# Altium schematic sheet MCU.SchDoc: Microcontroller Unit (MCU)
size A; Author: Micheal Burin; Revision: 1.0; SheetNumber: 2; SheetTotal: 10
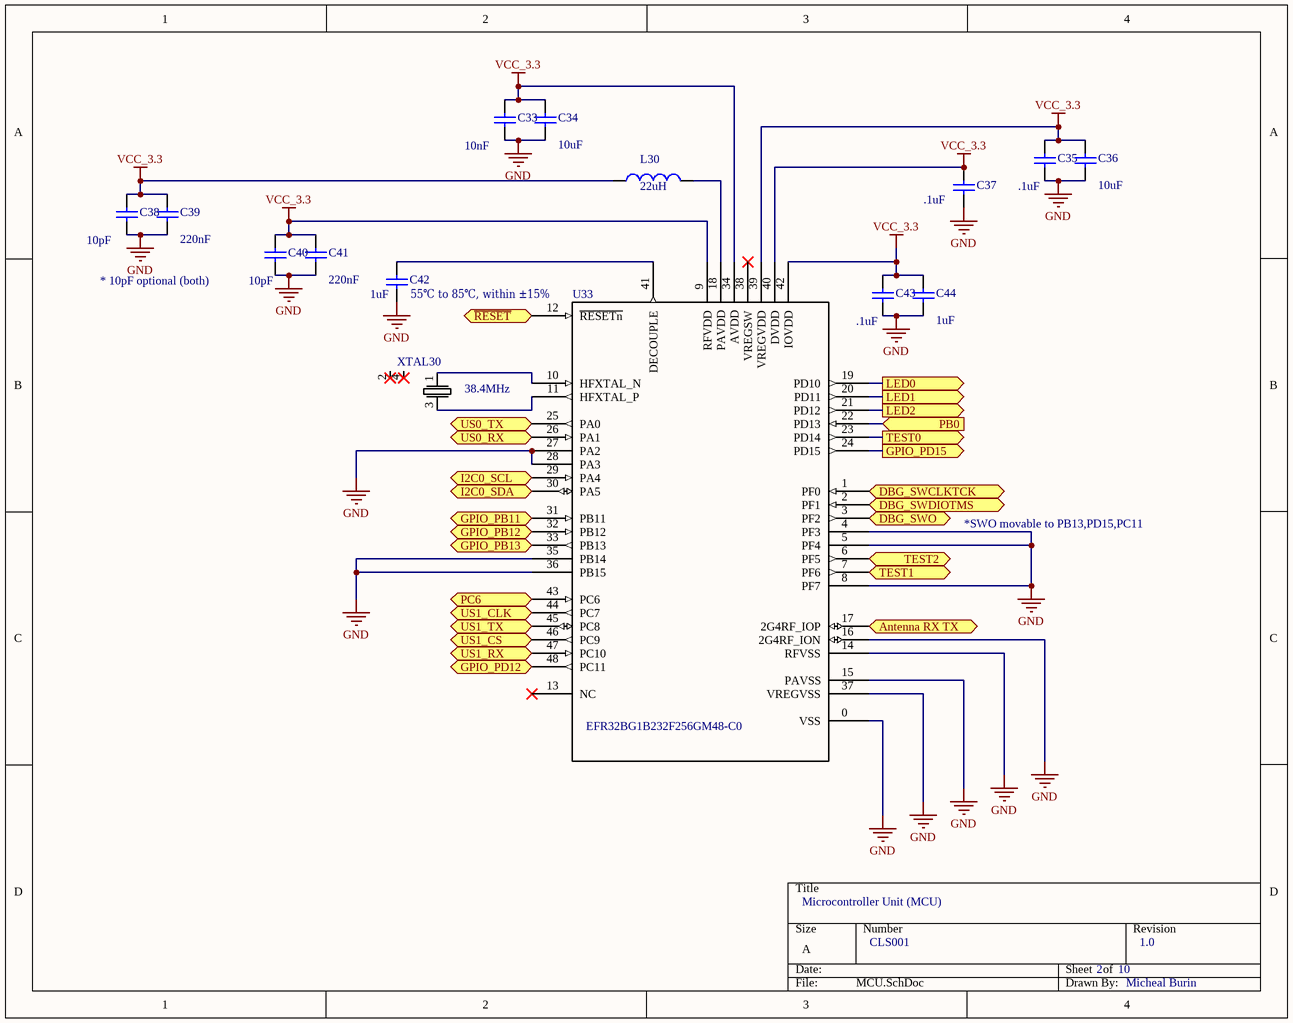
[diagram p0: MCU.SchDoc]

## Parts
C33  value 10nF  [0805_CHIP_FP]  (hidden comment: Capacitor_unpolarized_0805)
C34  value 10uF  [0805_CHIP_FP]  (hidden comment: Capacitor_unpolarized_0805)
C35  value .1uF  [0805_CHIP_FP]  (hidden comment: Capacitor_unpolarized_0805)
C36  value 10uF  [0805_CHIP_FP]  (hidden comment: Capacitor_unpolarized_0805)
C37  value .1uF  [0805_CHIP_FP]  (hidden comment: Capacitor_unpolarized_0805)
C38  value 10pF  [0805_CHIP_FP]  (hidden comment: Capacitor_unpolarized_0805)
C39  value 220nF  [0805_CHIP_FP]  (hidden comment: Capacitor_unpolarized_0805)
C40  value 10pF  [0805_CHIP_FP]  (hidden comment: Capacitor_unpolarized_0805)
C41  value 220nF  [0805_CHIP_FP]  (hidden comment: Capacitor_unpolarized_0805)
C42  value 1uF  [0805_CHIP_FP]  (hidden comment: Capacitor_unpolarized_0805)
C43  value .1uF  [0805_CHIP_FP]  (hidden comment: Capacitor_unpolarized_0805)
C44  value 1uF  [0805_CHIP_FP]  (hidden comment: Capacitor_unpolarized_0805)
L30  value 22uH  [0402_CHIP_FP]  (hidden comment: Inductor)
U33  EFR32BG1B232F256GM48-C0  [QFN127P600-8N]
XTAL30  crystal_4_legged  [OSC-DFN140P160X55-4N]  (value not drawn)

## Ports
Antenna RX TX (bidir), DBG_SWCLKTCK (in), DBG_SWDIOTMS (bidir), DBG_SWO (out), GPIO_PB11 (in), GPIO_PB12 (in), GPIO_PB13 (out), GPIO_PD12 (out), GPIO_PD15 (out), I2C0_SCL (out), I2C0_SDA (bidir), LED0 (out), LED1 (out), LED2 (out), PB0 (in), PC6 (in), TEST0 (out), TEST1 (out), TEST2 (out), US0_RX (in), US0_TX (out), US1_CLK (out), US1_CS (out), US1_RX (in), US1_TX (bidir), ~{RESET} (in)

## Nets
GND: C33.2 C34.2 C35.1 C36.1 C37.1 C38.1 C39.1 C40.1 C41.1 C42.1 C43.1 C44.1 U33.0(VSS) U33.4(PF3) U33.5(PF4) U33.8(PF7) U33.14(RFVSS) U33.15(PAVSS) U33.16(2G4RF_ION) U33.27(PA2) U33.28(PA3) U33.35(PB14) U33.36(PB15) U33.37(VREGVSS)
VCC_3.3: C33.1 C34.1 C35.2 C36.2 C37.2 C38.2 C39.2 C40.2 C41.2 C43.2 C44.2 L30.1 U33.9(RFVDD) U33.34(AVDD) U33.39(VREGVDD) U33.40(DVDD) U33.42(IOVDD)
Antenna RX TX: U33.17(2G4RF_IOP) ; port Antenna RX TX
DBG_SWCLKTCK: U33.1(PF0) ; port DBG_SWCLKTCK
DBG_SWDIOTMS: U33.2(PF1) ; port DBG_SWDIOTMS
DBG_SWO: U33.3(PF2) ; port DBG_SWO
GPIO_PB11: U33.31(PB11) ; port GPIO_PB11
GPIO_PB12: U33.32(PB12) ; port GPIO_PB12
GPIO_PB13: U33.33(PB13) ; port GPIO_PB13
GPIO_PD12: U33.48(PC11) ; port GPIO_PD12
GPIO_PD15: U33.24(PD15) ; port GPIO_PD15
I2C0_SCL: U33.29(PA4) ; port I2C0_SCL
I2C0_SDA: U33.30(PA5) ; port I2C0_SDA
LED0: U33.19(PD10) ; port LED0
LED1: U33.20(PD11) ; port LED1
LED2: U33.21(PD12) ; port LED2
PB0: U33.22(PD13) ; port PB0
PC6: U33.43(PC6) ; port PC6
~{RESET}: U33.12(~{RESETn}) ; port ~{RESET}
TEST0: U33.23(PD14) ; port TEST0
TEST1: U33.7(PF6) ; port TEST1
TEST2: U33.6(PF5) ; port TEST2
US0_RX: U33.26(PA1) ; port US0_RX
US0_TX: U33.25(PA0) ; port US0_TX
US1_CLK: U33.44(PC7) ; port US1_CLK
US1_CS: U33.46(PC9) ; port US1_CS
US1_RX: U33.47(PC10) ; port US1_RX
US1_TX: U33.45(PC8) ; port US1_TX
NetC42_2: C42.2 U33.41(DECOUPLE)
NetL30_2: L30.2 U33.18(PAVDD)
NetU33_10: U33.10(HFXTAL_N) XTAL30.1
NetU33_11: U33.11(HFXTAL_P) XTAL30.3

Not connected (* = marked no-connect by the designer): U33 13(NC)* 38(VREGSW)*; XTAL30 2* 4*

## Notes on the sheet
- * 10pF optional (both)
- 55℃ to 85℃, within ±15%
- (near XTAL30) 38.4MHz
- *SWO movable to PB13,PD15,PC11
- CLS001

## Library data of the parts
C33 = Capacitor_unpolarized_0805: Manufacturer: Samsung Electro-Mechanics; Manufacturer Part Number: CL21B103KAANNNC; Vendor Part Number: 1276-2434-1-ND; Vendor: Digikey; Vendor Description: CAP CER 10000PF 25V X7R 0805; ComponentLink1Description: Datasheet; ComponentLink1URL: https://www.digikey.com/product-detail/en/samsung-electro-mechanics/CL21B103KAANNNC/1276-2434-1-ND/3890520; Cost: .10
C34 C36 = Capacitor_unpolarized_0805: Manufacturer: Samsung Electro-Mechanics; Manufacturer Part Number: CL21A106KPFNNNG; Vendor Part Number: 1276-6456-1-ND; Vendor: Digikey; Vendor Description: CAP CER 10UF 10V X5R 0805; ComponentLink1Description: Datasheet; ComponentLink1URL: https://www.digikey.com/product-detail/en/samsung-electro-mechanics/CL21A106KPFNNNG/1276-6456-1-ND/5958084; Cost: .10
C35 C37 C43 = Capacitor_unpolarized_0805: Manufacturer: Johanson Dielectrics Inc.; Manufacturer Part Number: 250R15W104KV4T; Vendor Part Number: 709-1185-1-ND; Vendor: Digikey; Vendor Description: CAP CER 0.1UF 25V X7R 0805; ComponentLink1Description: Datasheet; ComponentLink1URL: https://www.digikey.com/product-detail/en/johanson-dielectrics-inc/250R15W104KV4T/709-1185-1-ND/1859517; Cost: .18
C38 C40 = Capacitor_unpolarized_0805: Manufacturer: Wurth Electronics Inc.; Manufacturer Part Number: 885012007028; Vendor Part Number: 732-7827-1-ND; Vendor: Digikey; Vendor Description: CAP CER 10PF 25V C0G/NP0 0805; ComponentLink1Description: Datasheet; ComponentLink1URL: https://www.digikey.com/product-detail/en/wurth-electronics-inc/885012007028/732-7827-1-ND/5454454; Cost: .04
C39 C41 = Capacitor_unpolarized_0805: Manufacturer: Wurth Electronics Inc.; Manufacturer Part Number: 885012207074; Vendor Part Number: 732-7668-1-ND; Vendor: Digikey; Vendor Description: CAP CER 0.22UF 25V X7R 0805; ComponentLink1Description: Datasheet; ComponentLink1URL: https://www.digikey.com/product-detail/en/wurth-electronics-inc/885012207074/732-7668-1-ND/5454295; Cost: .11
C42 C44 = Capacitor_unpolarized_0805: Manufacturer: Samsung Electro-Mechanics; Manufacturer Part Number: CL21A105KOFNNNE; Vendor Part Number: 1276-2888-1-ND; Vendor: Digikey; Vendor Description: CAP CER 1UF 16V X5R 0805; ComponentLink1Description: Datasheet; ComponentLink1URL: https://www.digikey.com/product-detail/en/samsung-electro-mechanics/CL21A105KOFNNNE/1276-2888-1-ND/3890974; Cost: .10
L30 = Inductor: Manufacturer: Murata Electronics North America; Manufacturer Part Number: LQG15HS22NJ02D; Vendor Part Number: 490-2627-1-ND; Vendor: Digikey; Vendor Description: FIXED IND 22NH 350MA 420 MOHM; ComponentLink1Description: Datasheet; ComponentLink1URL: https://www.digikey.com/product-detail/en/murata-electronics-north-america/LQG15HS22NJ02D/490-2627-1-ND/662907; Cost: .10
U33 = EFR32BG1B232F256GM48-C0: EFR32BG1B232F256GM48-C0 48 pin; Vendor Part Number: 634-EFR32BG232FGM48C; MF: Silicon Labs; Vendor: Mouser; Vendor Description: RF System on a Chip - SoC Blue Gecko SoC, 2.4 GHz, 256 kB Flash, 32 kB RAM, +10.5 dBm, QFN48, BLE; Value: *; Availability: Unavailable; MP: EFR32BG1B232F256GM48-C0; Price: None; Package: QFN-48; ComponentLink1Description: Datasheet; ComponentLink1URL: https://www.mouser.com/ProductDetail/Silicon-Labs/EFR32BG1B232F256GM48-C0?qs=sGAEpiMZZMuReUCzg6bfTBcjVff43OycMWdVD1zh22U6vZAa%252bEuL6w%3d%3d; Cost: 4.82; Manufacturer: Silicon Labs; Manufacturer Part Number: EFR32BG1B232F256GM48-C0
XTAL30 = crystal_4_legged: crystal; Manufacturer: CTS-Frequency Controls; Manufacturer Part Number: 402F38411CAR; Vendor Part Number: CTX1354CT-ND; Vendor: Digikey; Vendor Description: CRYSTAL 38.4000MHZ 10PF SMD; ComponentLink1Description: Datasheet; ComponentLink1URL: https://www.digikey.com/product-detail/en/cts-frequency-controls/402F38411CAR/CTX1354CT-ND/4972892; Cost: .88